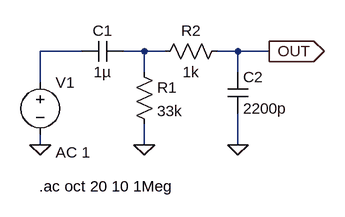
[diagram p0: schematic FV-1_Out_Filter.asc]
FV-1_Out_Filter.asc, the LTspice schematic file:
Version 4
SHEET 1 880 680
WIRE 64 128 0 128
WIRE 160 128 128 128
WIRE 192 128 160 128
WIRE 304 128 272 128
WIRE 352 128 304 128
WIRE 160 160 160 128
WIRE 304 160 304 128
WIRE 0 176 0 128
WIRE 0 272 0 256
WIRE 160 272 160 240
WIRE 304 272 304 224
FLAG 0 272 0
FLAG 160 272 0
FLAG 304 272 0
FLAG 352 128 OUT
IOPIN 352 128 Out
SYMBOL cap 128 112 R90
WINDOW 0 0 32 VBottom 2
WINDOW 3 32 32 VTop 2
SYMATTR InstName C1
SYMATTR Value 1µ
SYMBOL cap 288 160 R0
SYMATTR InstName C2
SYMATTR Value 2200p
SYMBOL res 144 144 R0
SYMATTR InstName R1
SYMATTR Value 33k
SYMBOL res 288 112 R90
WINDOW 0 0 56 VBottom 2
WINDOW 3 32 56 VTop 2
SYMATTR InstName R2
SYMATTR Value 1k
SYMBOL voltage 0 160 R0
WINDOW 123 24 124 Left 2
WINDOW 39 0 0 Left 0
SYMATTR InstName V1
SYMATTR Value ""
SYMATTR Value2 AC 1
TEXT -2 336 Left 2 !.ac oct 20 10 1Meg

The netlist it stands for:
* FV-1_Out_Filter.asc
C1 N002 N001 1µ
C2 OUT 0 2200p
R1 N002 0 33k
R2 OUT N002 1k
V1 N001 0 AC 1
.ac oct 20 10 1Meg
.backanno
.end